# Altium schematic sheet POWER.SchDoc
size A4
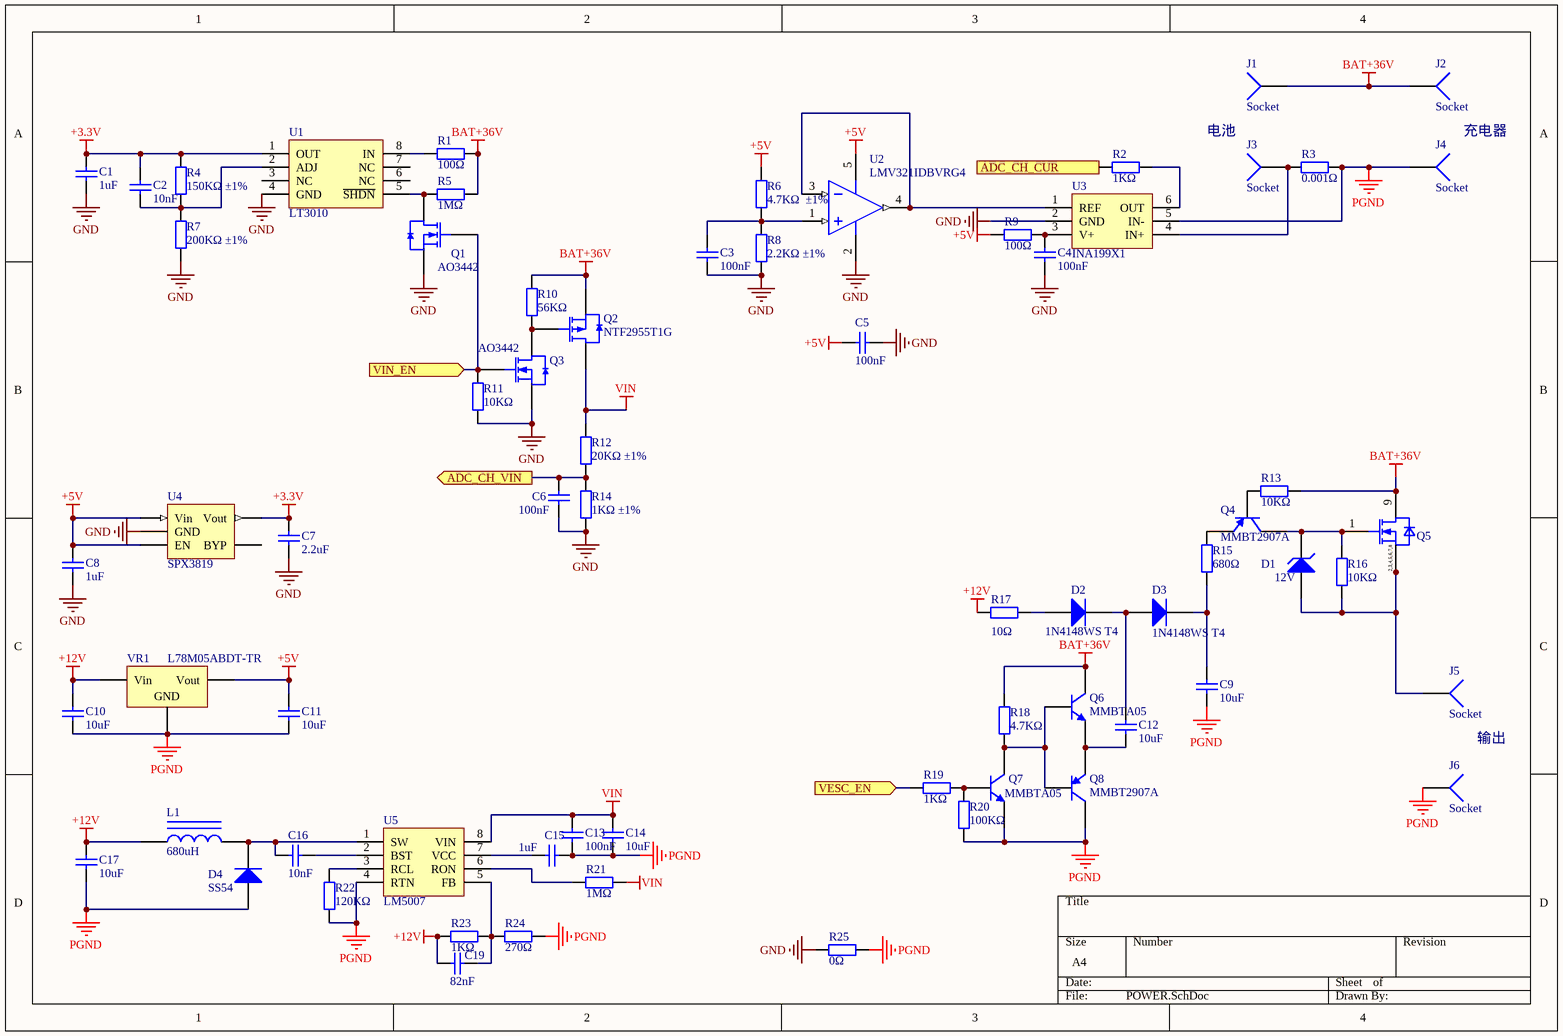
[diagram p0: POWER.SchDoc]

## Parts
C1  1uF  [0603_C]
C2  10nF  [0402_C]
C3  100nF  [0402_C]
C4  100nF  [0402_C]
C5  100nF  [0402_C]
C6  100nF  [0402_C]
C7  2.2uF  [0603_C]
C8  1uF  [0603_C]
C9  10uF  [0805_C]
C10  10uF  [0805_C]
C11  10uF  [0805_C]
C12  10uF  [0805_C]
C13  100nF  [0805_C]
C14  10uF  [1206_C]
C15  1uF  [0402_C]
C16  10nF  [0603_C]
C17  10uF  [1206_C]
C19  82nF  [0402_C]
D1  12V  [LL-34]
D2  1N4148WS T4  [SOD-323]
D3  1N4148WS T4  [SOD-323]
D4  SS54  [SMA(DO-214AC)_S1]
J1  Socket  [PIN1]
J2  Socket  [PIN1]
J3  Socket  [PIN1]
J4  Socket  [PIN1]
J5  Socket  [PIN1]
J6  Socket  [PIN1]
L1  680uH  [CDRH74]
Q1  AO3442  [SOT-23-3L]
Q2  NTF2955T1G  [SOT-223]
Q3  AO3442  [SOT-23-3L]
Q4  MMBT2907A  [SOT-23(SOT-23-3)]
Q5  IPT007N06N  [INF-PG-HSOF-8-1-0]  (value not drawn)
Q6  MMBTA05  [SOT-23(SOT-23-3)]
Q7  MMBTA05  [SOT-23(SOT-23-3)]
Q8  MMBT2907A  [SOT-23(SOT-23-3)]
R1  100Ω  [0402_R]
R2  1KΩ  [0402_R]
R3  0.001Ω  [2512_R]
R4  150KΩ ±1%  [0402_R]
R5  1MΩ  [0402_R]
R6  4.7KΩ  ±1%  [0402_R]
R7  200KΩ ±1%  [0402_R]
R8  2.2KΩ ±1%  [0402_R]
R9  100Ω  [0402_R]
R10  56KΩ  [0402_R]
R11  10KΩ  [0402_R]
R12  20KΩ ±1%  [0402_R]
R13  10KΩ  [0603_R]
R14  1KΩ ±1%  [0402_R]
R15  680Ω  [0603_R]
R16  10KΩ  [0603_R]
R17  10Ω  [0603_R]
R18  4.7KΩ  [0603_R]
R19  1KΩ  [0603_R]
R20  100KΩ  [0603_R]
R21  1MΩ  [0402_R]
R22  120KΩ  [0402_R]
R23  1KΩ  [0402_R]
R24  270Ω  [0402_R]
R25  0Ω  [0603_R]
U1  LT3010  [MSOP-8_EP]
U2  LMV321IDBVRG4  [SOT-23-5]
U3  INA199X1  [DCK0006A_N]
U4  SPX3819  [SOT25-5]
U5  LM5007  [MSOP-8]
VR1  L78M05ABDT-TR  [TO-252-2-180]

## Ports
ADC_CH_CUR (out), ADC_CH_VIN (out), VESC_EN (in), VIN_EN (in)

## Nets
+3.3V: C1.2 C2.2 C7.2 R4.2 U1.1(OUT) U4.5(Vout)
+5V: C5.2 C8.2 C11.2 R6.2 R9.1 U2.5(V+) U4.1(Vin) U4.3(EN) VR1.3(Vout)
+12V: C10.2 C17.1 C19.1 L1.1 R17.2 R23.1 VR1.1(Vin)
BAT+36V: J1.1 J2.1 Q2.3(S) Q5.9(DRAIN) Q6.3(C) R1.2 R5.2 R10.2 R13.1 R18.2
GND: C1.1 C3.1 C4.1 C5.1 C6.1 C7.1 C8.1 Q1.2(S) Q3.2(S) R7.1 R8.1 R11.1 R14.1 R25.1 U1.4(GND) U2.2(V-) U3.2(GND) U4.2(GND)
PGND: C9.1 C10.1 C11.1 C13.1 C14.2 C15.2 C17.2 D4.1(A) J4.1 J6.1 Q7.2(E) Q8.3(C) R3.1 R20.1 R22.1 R24.2 R25.2 U3.5(IN-) U5.4(RTN) VR1.2(GND)
VIN: C13.2 C14.1 Q2.2(D) R12.2 R21.2 U5.8(VIN)
ADC_CH_CUR: R2.1 ; port ADC_CH_CUR
ADC_CH_VIN: C6.2 R12.1 R14.2 ; port ADC_CH_VIN
VESC_EN: R19.1 ; port VESC_EN
VIN_EN: Q1.1(G) Q3.1(G) R11.2 ; port VIN_EN
NetC2_1: C2.1 R4.1 R7.2 U1.2(ADJ)
NetC3_2: C3.2 R6.1 R8.2 U2.1(IN+)
NetC4_2: C4.2 R9.2 U3.3(V+)
NetC9_2: C9.2 D3.2(K) R15.2
NetC12_1: C12.1 Q6.2(E) Q8.2(E)
NetC12_2: C12.2 D2.2(K) D3.1(A)
NetC15_1: C15.1 U5.7(VCC)
NetC16_1: C16.1 D4.2(K) L1.2 U5.1(SW)
NetC16_2: C16.2 U5.2(BST)
NetC19_2: C19.2 R23.2 R24.1 U5.5(FB)
NetD1_1: D1.1(A) J5.1 Q5.2(SOURCE) Q5.3(SOURCE) Q5.4(SOURCE) Q5.5(SOURCE) Q5.6(SOURCE) Q5.7(SOURCE) Q5.8(SOURCE) R16.1
NetD1_2: D1.2(K) Q4.3(C) Q5.1(GATE) R16.2
NetD2_1: D2.1(A) R17.1
NetJ3_1: J3.1 R3.2 U3.4(IN+)
NetQ1_3: Q1.3(D) R5.1 U1.5(~{SHDN})
NetQ2_1: Q2.1(G) Q3.3(D) R10.1
NetQ4_1: Q4.1(B) R13.2
NetQ4_2: Q4.2(E) R15.1
NetQ6_1: Q6.1(B) Q7.3(C) Q8.1(B) R18.1
NetQ7_1: Q7.1(B) R19.2 R20.2
NetR1_1: R1.1 U1.8(IN)
NetR2_2: R2.2 U3.6(OUT)
NetR21_1: R21.1 U5.6(RON)
NetR22_2: R22.2 U5.3(RCL)
NetU2_3: U2.3(IN-) U2.4(OUT) U3.1(REF)

Not connected (* = marked no-connect by the designer): U1 3(NC) 6(NC) 7(NC); U4 4(BYP)

## Notes on the sheet
- 电池
- 充电器
- 输出
- (in symbol IPT007N06N) 2,3,4,5,6,7,8

## Library data of the parts
C1 C8 C15 = 0603 1uF (105) 10% 50V: 贴片电容; ComponentLink1Description: 供应商链接; ComponentLink1URL: http://www.szlcsc.com/product/details_16531.html; Package: 0603; Supplier: LC; SuppliersPartNumber: C15849
C2 = 0402 10nF (103) 10% 50V: 贴片电容; ComponentLink1Description: 供应商链接; ComponentLink1URL: http://www.szlcsc.com/product/details_15869.html; Package: 0402; Supplier: LC; SuppliersPartNumber: C15195
C3-C6 = 0402 100nF (104) 10% 16V: 贴片电容; ComponentLink1Description: 供应商链接; ComponentLink1URL: http://www.szlcsc.com/product/details_1877.html; Package: 0402; Supplier: LC; SuppliersPartNumber: C1525
C7 = 0603 2.2uF (225) 10% 16V: 贴片电容; ComponentLink1Description: 供应商链接; ComponentLink1URL: http://www.szlcsc.com/product/details_24366.html; Package: 0603; Supplier: LC; SuppliersPartNumber: C23630
C9-C12 = 0805 10uF (106) 10% 25V: 贴片电容; ComponentLink1Description: 供应商链接; ComponentLink1URL: http://www.szlcsc.com/product/details_16532.html; Package: 0805; Supplier: LC; SuppliersPartNumber: C15850
C13 = 0805 100nF(104) 10% 50V: 贴片电容; ComponentLink1Description: 供应商链接; ComponentLink1URL: http://www.szlcsc.com/product/details_50686.html; Package: 0805; Supplier: LC; SuppliersPartNumber: C49678
C14 C17 = 1206 10uF (106) 10% 50V: 贴片电容; ComponentLink1Description: 供应商链接; ComponentLink1URL: http://www.szlcsc.com/product/details_14236.html; Package: 1206; Supplier: LC; SuppliersPartNumber: C13585
C16 = 0603 10nF (103) 10% 50V: 贴片电容; ComponentLink1Description: 供应商链接; ComponentLink1URL: http://www.szlcsc.com/product/details_58143.html; Package: 0603; Supplier: LC; SuppliersPartNumber: C57112
C19 = 0603 82pF (820) 5% 50V: 贴片电容; ComponentLink1Description: 供应商链接; ComponentLink1URL: http://www.szlcsc.com/product/details_2035.html; Package: 0603; Supplier: LC; SuppliersPartNumber: C1683
D1 = LL-34 ZMM5V6: 稳压二极管; ComponentLink1Description: 供应商链接; ComponentLink1URL: http://www.szlcsc.com/product/details_8541.html; Package: LL-34; Supplier: LC; SuppliersPartNumber: C8062
D2 D3 = SOD-323 1N4148WS T4: 二极管; ComponentLink1Description: 供应商链接; ComponentLink1URL: http://www.szlcsc.com/product/details_2485.html; Package: SOD-323; Supplier: LC; SuppliersPartNumber: C2128
D4 = SMA(DO-214AC) SS54: 二极管; ComponentLink1Description: 供应商链接; ComponentLink1URL: http://www.szlcsc.com/product/details_23178.html; Package: SMA(DO-214AC); Supplier: LC; SuppliersPartNumber: C22452
L1 = 0805 10uH 10%: 贴片电感; ComponentLink1Description: 供应商链接; ComponentLink1URL: http://www.szlcsc.com/product/details_1398.html; Package: 0805; Supplier: LC; SuppliersPartNumber: C1046
Q1 Q3 = AO3400A N道沟 X0YV1T SOT-23: MOS(场效应管); ComponentLink1Description: 供应商链接; ComponentLink1URL: http://www.szlcsc.com/product/details_21629.html; Package: SOT-23; Supplier: LC; SuppliersPartNumber: C20917
Q2 = AO3401A P道沟 X13A15 SOT-23: MOS(场效应管); ComponentLink1Description: 供应商链接; ComponentLink1URL: http://www.szlcsc.com/product/details_15801.html; Package: SOT-23; Supplier: LC; SuppliersPartNumber: C15127
Q4 Q8 = SOT-23 SS8550 Y2: 三极管; ComponentLink1Description: 供应商链接; ComponentLink1URL: http://www.szlcsc.com/product/details_9037.html; Package: SOT-23; Supplier: LC; SuppliersPartNumber: C8542
Q5 = IPT007N06N: OptiMOS N-Channel Power-Transistor; Manufacturer: Infineon Technologies; ManufacturerPartNumber: IPT007N06N; PackageReference: PG-HSOF-8-1
Q6 Q7 = SOT-23 SS8050 Y1: 三极管; ComponentLink1Description: 供应商链接; ComponentLink1URL: http://www.szlcsc.com/product/details_2507.html; Package: SOT-23; Supplier: LC; SuppliersPartNumber: C2150
R1 R9 = 0402 100Ω (1000) 1%: 贴片电阻; ComponentLink1Description: 供应商链接; ComponentLink1URL: http://www.szlcsc.com/product/details_25819.html; Package: 0402; Supplier: LC; SuppliersPartNumber: C25076
R2 R14 R23 = 0402 1KΩ (1001) 1%: 贴片电阻; ComponentLink1Description: 供应商链接; ComponentLink1URL: http://www.szlcsc.com/product/details_12256.html; Package: 0402; Supplier: LC; SuppliersPartNumber: C11702
R3 R25 = 0603 0Ω (0R0) 1%: 贴片电阻; ComponentLink1Description: 供应商链接; ComponentLink1URL: http://www.szlcsc.com/product/details_21903.html; Package: 0603; Supplier: LC; SuppliersPartNumber: C21189
R4 = 0402 150KΩ (1503) 1%: 贴片电阻; ComponentLink1Description: 供应商链接; ComponentLink1URL: http://www.szlcsc.com/product/details_26498.html; Package: 0402; Supplier: LC; SuppliersPartNumber: C25755
R5 R21 = 0402 1MΩ (1004) 1%: 贴片电阻; ComponentLink1Description: 供应商链接; ComponentLink1URL: http://www.szlcsc.com/product/details_26826.html; Package: 0402; Supplier: LC; SuppliersPartNumber: C26083
R6 = 0402 4.7KΩ (4701) 1%: 贴片电阻; ComponentLink1Description: 供应商链接; ComponentLink1URL: http://www.szlcsc.com/product/details_26643.html; Package: 0402; Supplier: LC; SuppliersPartNumber: C25900
R7 = 0402 200KΩ (2003) 1%: 贴片电阻; ComponentLink1Description: 供应商链接; ComponentLink1URL: http://www.szlcsc.com/product/details_26507.html; Package: 0402; Supplier: LC; SuppliersPartNumber: C25764
R8 = 0402 2.2KΩ (2201) 1%: 贴片电阻; ComponentLink1Description: 供应商链接; ComponentLink1URL: http://www.szlcsc.com/product/details_26622.html; Package: 0402; Supplier: LC; SuppliersPartNumber: C25879
R10 = 0402 56KΩ (5602) 1%: 贴片电阻; ComponentLink1Description: 供应商链接; ComponentLink1URL: http://www.szlcsc.com/product/details_26539.html; Package: 0402; Supplier: LC; SuppliersPartNumber: C25796
R11 = 0402 10KΩ (1002) 1%: 贴片电阻; ComponentLink1Description: 供应商链接; ComponentLink1URL: http://www.szlcsc.com/product/details_26487.html; Package: 0402; Supplier: LC; SuppliersPartNumber: C25744
R12 = 0402 20KΩ (2002) 1%: 贴片电阻; ComponentLink1Description: 供应商链接; ComponentLink1URL: http://www.szlcsc.com/product/details_26508.html; Package: 0402; Supplier: LC; SuppliersPartNumber: C25765
R13 R16 = 0603 10KΩ (1002) 1%: 贴片电阻; ComponentLink1Description: 供应商链接; ComponentLink1URL: http://www.szlcsc.com/product/details_26547.html; Package: 0603; Supplier: LC; SuppliersPartNumber: C25804
R15 R17 = 0603 680Ω (6800) 1%: 贴片电阻; ComponentLink1Description: 供应商链接; ComponentLink1URL: http://www.szlcsc.com/product/details_23955.html; Package: 0603; Supplier: LC; SuppliersPartNumber: C23228
R18 = 0603 4.7KΩ (4701) 1%: 贴片电阻; ComponentLink1Description: 供应商链接; ComponentLink1URL: http://www.szlcsc.com/product/details_23889.html; Package: 0603; Supplier: LC; SuppliersPartNumber: C23162
R19 = 0603 1KΩ (1001) 1%: 贴片电阻; ComponentLink1Description: 供应商链接; ComponentLink1URL: http://www.szlcsc.com/product/details_21904.html; Package: 0603; Supplier: LC; SuppliersPartNumber: C21190
R20 = 0603 30KΩ (3002) 1%: 贴片电阻; ComponentLink1Description: 供应商链接; ComponentLink1URL: http://www.szlcsc.com/product/details_23711.html; Package: 0603; Supplier: LC; SuppliersPartNumber: C22984
R22 = 0402 120KΩ (1203) 1%: 贴片电阻; ComponentLink1Description: 供应商链接; ComponentLink1URL: http://www.szlcsc.com/product/details_26493.html; Package: 0402; Supplier: LC; SuppliersPartNumber: C25750
R24 = 0603 270Ω (2700) 1%: 贴片电阻; ComponentLink1Description: 供应商链接; ComponentLink1URL: http://www.szlcsc.com/product/details_23693.html; Package: 0603; Supplier: LC; SuppliersPartNumber: C22966
U1 = LT3010: 50mA、3V 至 80V 低压差微功率稳压器
U2 = LMV321IDBVRG4: 运放; ComponentLink1Description: 供应商链接; ComponentLink1URL: http://www.szlcsc.com/product/details_8449.html; Package: SOT-23-5; Supplier: LC; SuppliersPartNumber: C7972
U5 = LM5007: 降压开关稳压器
VR1 = TO-252-2 L78M05ABDT-TR: 低压差线性稳压(LDO); ComponentLink1Description: 供应商链接; ComponentLink1URL: http://www.szlcsc.com/product/details_59107.html; Package: TO-252-2; Supplier: LC; SuppliersPartNumber: C58069
J1-J6 = Socket: LatestRevisionDate: 17-Jul-2002; LatestRevisionNote: Re-released for DXP Platform.; Publisher: Altium Limited